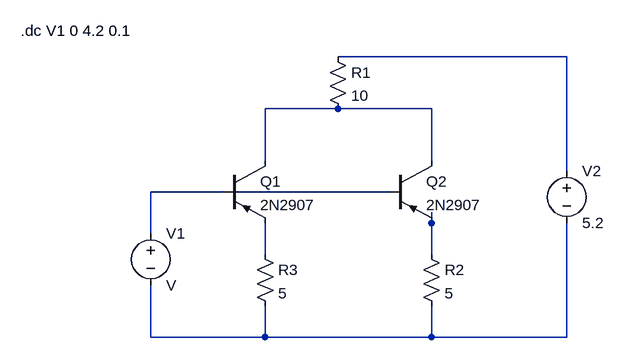
[diagram p0: schematic Battery_charger.asc]
Battery_charger.asc, the LTspice schematic file:
Version 4
SHEET 1 880 680
WIRE 752 -32 400 -32
WIRE 400 48 288 48
WIRE 544 48 400 48
WIRE 288 128 288 48
WIRE 544 128 544 48
WIRE 752 144 752 -32
WIRE 224 176 112 176
WIRE 480 176 240 176
WIRE 544 224 544 208
WIRE 112 240 112 176
WIRE 288 272 288 224
WIRE 544 272 544 224
WIRE 112 400 112 320
WIRE 288 400 288 352
WIRE 288 400 112 400
WIRE 544 400 544 352
WIRE 544 400 288 400
WIRE 752 400 752 224
WIRE 752 400 544 400
SYMBOL pnp 224 128 R0
SYMATTR InstName Q1
SYMATTR Value 2N2907
SYMBOL res 272 256 R0
SYMATTR InstName R3
SYMATTR Value 5
SYMBOL voltage 112 224 R0
SYMATTR InstName V1
SYMBOL pnp 480 128 R0
SYMATTR InstName Q2
SYMATTR Value 2N2907
SYMBOL res 528 256 R0
SYMATTR InstName R2
SYMATTR Value 5
SYMBOL voltage 752 128 R0
WINDOW 123 0 0 Left 0
WINDOW 39 0 0 Left 0
SYMATTR InstName V2
SYMATTR Value 5.2
SYMBOL res 384 -48 R0
SYMATTR InstName R1
SYMATTR Value 10
TEXT -88 -72 Left 2 !.dc V1 0 4.2 0.1

The netlist it stands for:
* Battery_charger.asc
Q1 N002 N003 N006 0 2N2907
R3 N006 N007 5
V1 N003 N007 V
Q2 N002 N004 N005 0 2N2907
R2 N005 N007 5
V2 N001 N007 5.2
R1 N001 N002 10
.model NPN NPN
.model PNP PNP
.lib standard.bjt
.dc V1 0 4.2 0.1
.backanno
.end